# EAGLE design Washer Machine Status Inland ESP32 1206 (EAGLE 9.6.2)
AUTHOR: Eric Snis; REV: 1
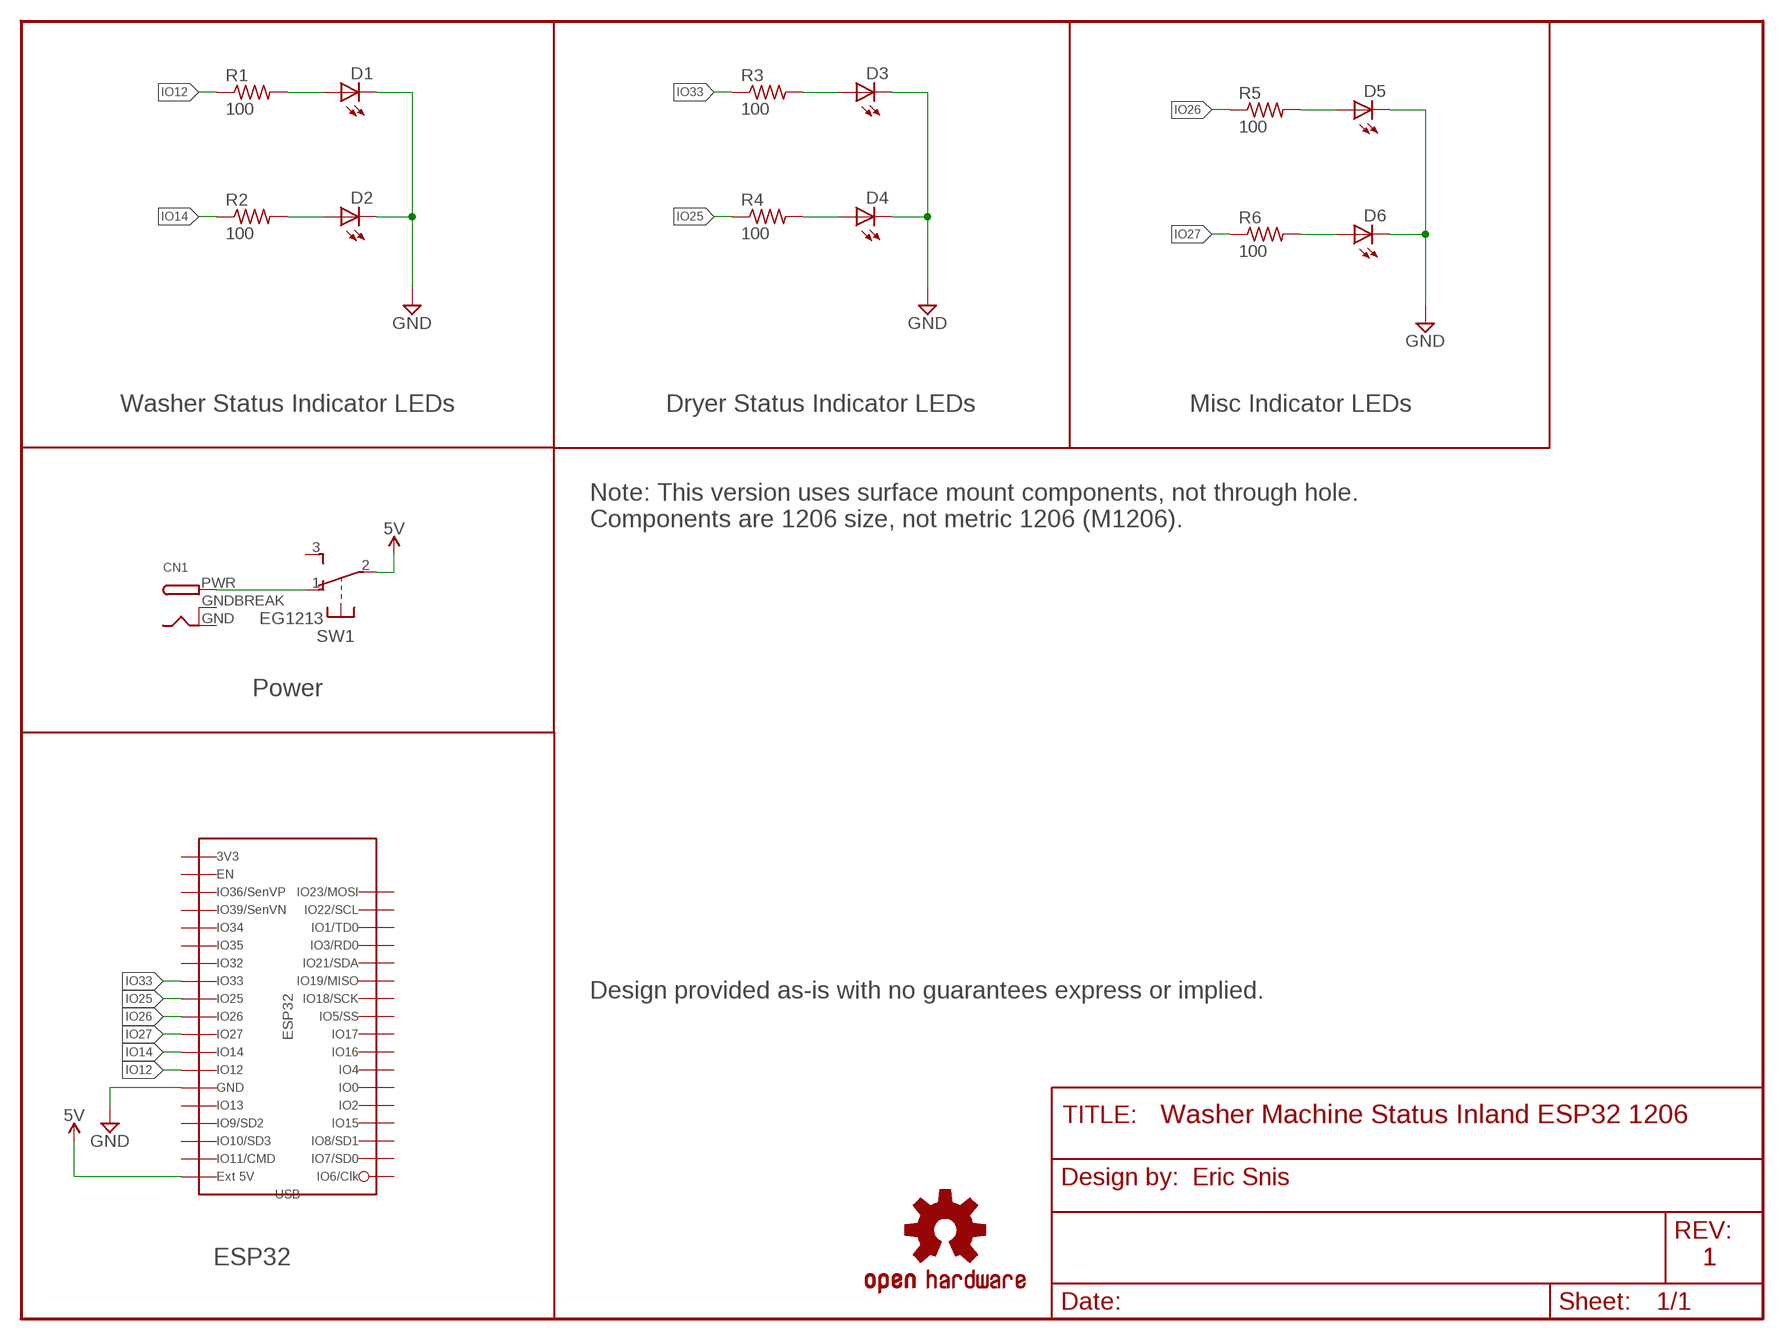
[diagram p0: schematic, sheet 1]

## Parts
CN1  DCBARRELPTH  [DCJACK_2MM_PTH]
D1  Green  LED-CHIPLED_1206_LONG  [CHIPLED_1206_LONG]
D2  Red  LED-CHIPLED_1206_LONG  [CHIPLED_1206_LONG]
D3  Green  LED-CHIPLED_1206_LONG  [CHIPLED_1206_LONG]
D4  Red  LED-CHIPLED_1206_LONG  [CHIPLED_1206_LONG]
D5  Green  LED-CHIPLED_1206_LONG  [CHIPLED_1206_LONG]
D6  Red  LED-CHIPLED_1206_LONG  [CHIPLED_1206_LONG]
LOGO2  OSHW-LOGOMINI  [OSHW-LOGO-MINI]
R1  100  R_USR1206  [R1206]
R2  100  R_USR1206  [R1206]
R3  100  R_USR1206  [R1206]
R4  100  R_USR1206  [R1206]
R5  100  R_USR1206  [R1206]
R6  100  R_USR1206  [R1206]
SW  EG1213  [EG1213]
U$3  ESP32-INLAND  [ESP32_INLAND]

## Nets
5V: SW.2(1:P) U$3.5V(EXT_5V)
GND: D1.C D2.C D3.C D4.C D5.C D6.C U$3.GND1 U$3.GND2(GND1) U$3.GND(GND1)
IO12: R1.1 U$3.IO12
IO14: R2.1 U$3.IO14
IO25: R4.1 U$3.IO25
IO26: R5.1 U$3.IO26
IO27: R6.1 U$3.IO27
IO33: R3.1 U$3.IO33
N$1: CN1.PWR SW.1(1:O)
N$2: D5.A R5.2
N$3: D1.A R1.2
N$4: D2.A R2.2
N$5: D3.A R3.2
N$6: D4.A R4.2
N$7: D6.A R6.2
Unconnected: SW.3(1:S) SW.MT1(MT) SW.MT2(MT) U$3.CLK U$3.CMD(IO11/CMD) U$3.EN U$3.IO0 U$3.IO2 U$3.IO4 U$3.IO5 U$3.IO13 U$3.IO15 U$3.IO16 U$3.IO17 U$3.IO18 U$3.IO19 U$3.IO21(IO21/SDA) U$3.IO22 U$3.IO23(IO23/SCL) U$3.IO32 U$3.IO34 U$3.IO35 U$3.RXD0 U$3.SD0 U$3.SD1 U$3.SD2(IO9/SD2) U$3.SD3(IO10/SD3) U$3.SVN(IO39/SVN) U$3.SVP(IO36/SVP) U$3.TXD0

## Notes on the sheet
- Washer Status Indicator LEDs | Dryer Status Indicator LEDs | Misc Indicator LEDs
- Note: This version uses surface mount components, not through hole.
  Components are 1206 size, not metric 1206 (M1206).
- Power
- Design provided as-is with no guarantees express or implied.
- ESP32

## Power pins joined to a net without a drawn wire
3V3: U$3.3V3
GND: CN1.GND
GNDBREAK: CN1.GNDBREAK

## Library data of the parts
CN1 = connectors:DCBARREL: 2.0mm DC Barrel Jack DCJACK_2MM_PTH - Through Hole Jack (4UConnector: 05537)
D1-D6 = Transistors MOSFETs:LED: LED White LED 0.1" pitch
LOGO2 = SparkFun-Aesthetics:OSHW-LOGO: Open-Source Hardware (OSHW) Logo This logo indicates the piece of hardware it is found on incorporates a OSHW license and/or adheres to the definition of open source hardware found here: http://freedomdefined.org/OSHW
R1-R6 = passives:R_US: Resistor 7mm pin spacing
SW = adafruit:EG1213: E-Switch right-angle slide SPDT Part #EG1213 http://www.ladyada.net/library/eagle
U$3 = connectors:ESP32: ESP-32-Dev ESP32 from Inland/Microcenter

## Board
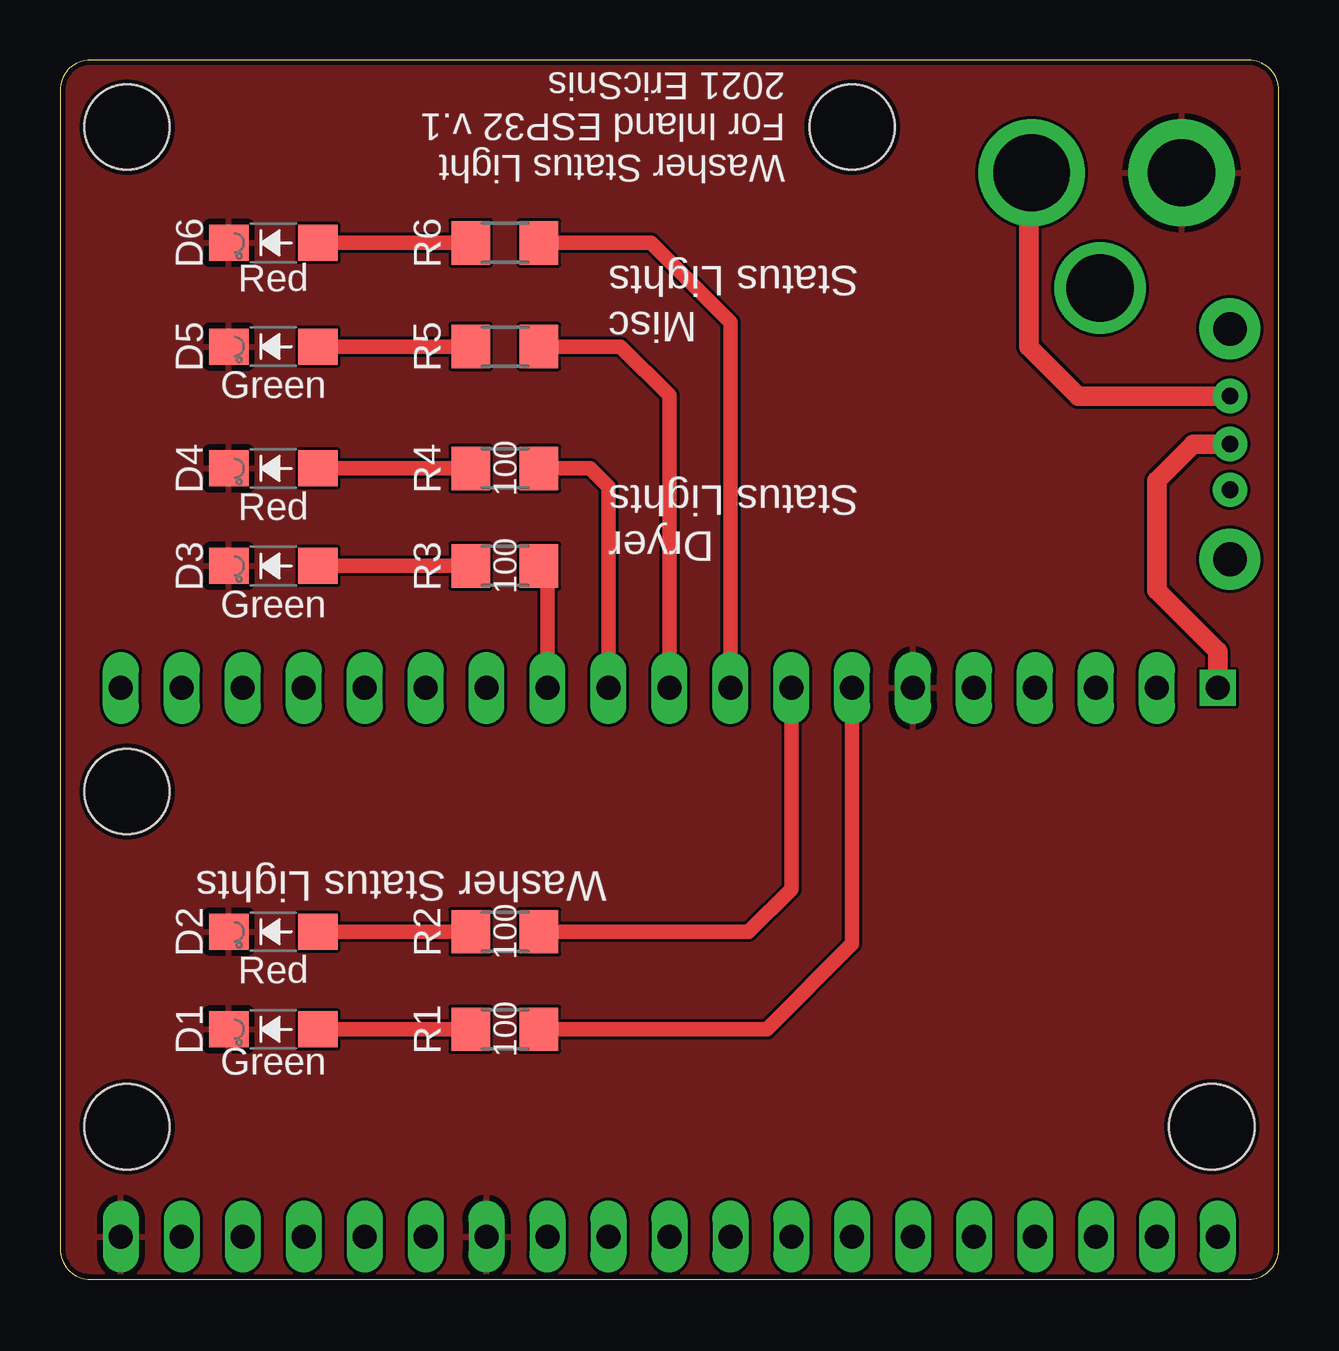
[diagram p1: board, top side]
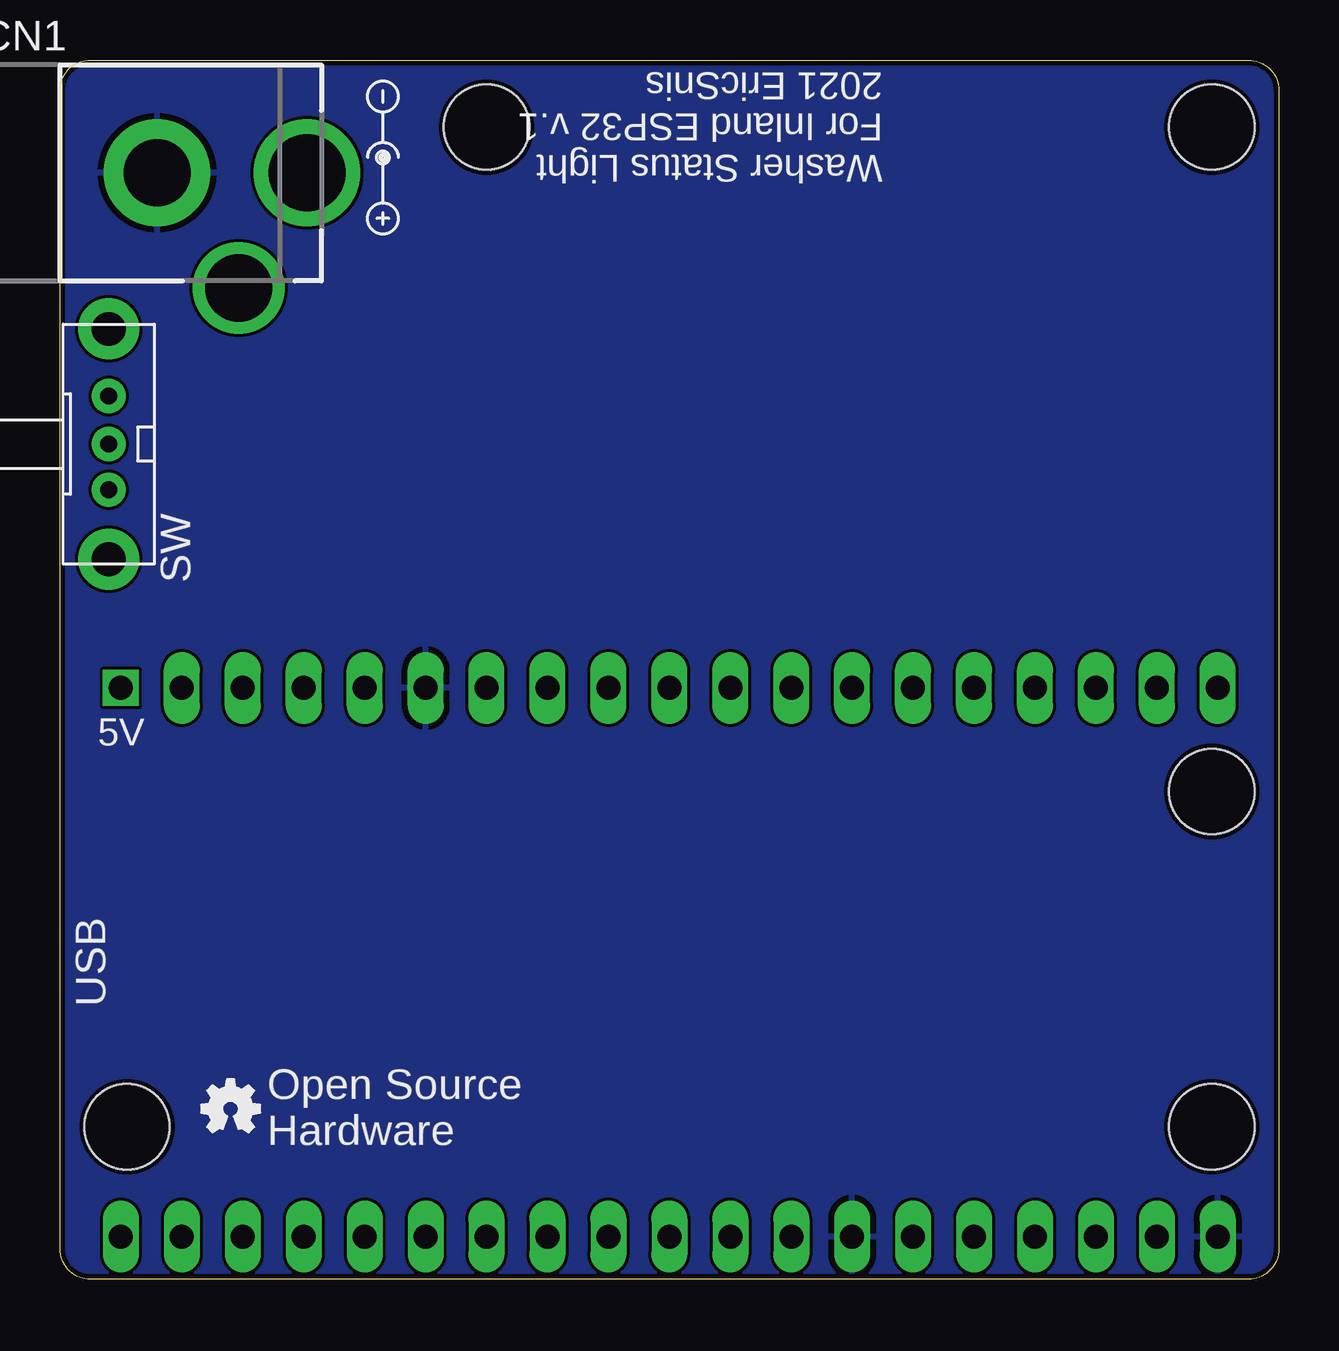
[diagram p2: board, bottom side, seen from below]

Size 50.8 x 50.8 mm. Coordinates in mm from the lower left corner, seen from the top.
Outline: 50.8,1.27 50.8,49.53 arc90 49.53,50.8 1.27,50.8 arc90 0,49.53 0,1.27 arc90 1.27,0 49.53,0 arc90 50.8,1.27
Copper layers (1*16): Top 0.035559375mm / dielectric 1.6mm / Bottom 0.035559375mm
Design rules "Digikey DKRed": minimum track width 5mil, minimum drill 8mil, track to track 5mil, track to pad 5mil, pad to pad 5mil, via to via 5mil, smd to smd 5mil, copper to edge 8mil, drill to drill 6mil, minimum pad ring 5mil, minimum via ring 3mil, stop-mask expansion 2.5mil, vias tented up to drill 0mil, thermal gap 10mil
Holes 3.56 mm at 2.79,6.35 48.01,6.35 2.79,20.32 2.79,48.01 33.02,48.01

### Footprints (pad centres in the part's own frame; a part is rotated, then mirrored left to right if it is on the bottom)
DCJACK_2MM_PTH = drill 2.8 pad 4.445: GND 0,7.35 | drill 2.8: GNDBREAK 4.8,10.75 | drill 3.2 pad 4.445: PWR 0,13.6
CHIPLED_1206_LONG = smd 1.5 x 1.651: A 0,-1.854; C 0,1.854
R1206 = smd 1.6 x 1.803: 1 -1.422,0; 2 1.422,0
EG1213 = drill 0.7 pad 1.422: 1 -2,0; 2 0,0; 3 1.9,0 | drill 1.4 pad 2.54: MT1 -4.8,0; MT2 4.8,0
ESP32_INLAND = drill 1 long: 3V3 11.43,-22.86; CLK -11.43,22.86; CMD 11.43,20.32; EN 11.43,-20.32; GND 11.43,10.16; GND1 -11.43,-22.86; GND2 -11.43,-7.62; IO0 -11.43,10.16; IO2 -11.43,12.7; IO4 -11.43,7.62; IO5 -11.43,0; IO12 11.43,7.62; IO13 11.43,12.7; IO14 11.43,5.08; IO15 -11.43,15.24; IO16 -11.43,5.08; IO17 -11.43,2.54; IO18 -11.43,-2.54; IO19 -11.43,-5.08; IO21 -11.43,-10.16; IO22 -11.43,-17.78; IO23 -11.43,-20.32; IO25 11.43,-2.54; IO26 11.43,0; IO27 11.43,2.54; IO32 11.43,-7.62; IO33 11.43,-5.08; IO34 11.43,-12.7; IO35 11.43,-10.16; RXD0 -11.43,-12.7; SD0 -11.43,20.32; SD1 -11.43,17.78; SD2 11.43,15.24; SD3 11.43,17.78; SVN 11.43,-15.24; SVP 11.43,-17.78; TXD0 -11.43,-15.24 | drill 1 square: 5V 11.43,22.86

### Placement (x,y rotation side)
CN1  54.1,46.1 270 bottom
D1  8.89,10.41 90 top
D2  8.89,14.48 90 top
D3  8.89,29.72 90 top
D4  8.89,33.78 90 top
D5  8.89,38.86 90 top
D6  8.89,43.18 90 top
LOGO2  43.69,7.11 0 bottom
R1  18.54,10.41 180 top
R2  18.54,14.48 180 top
R3  18.54,29.72 180 top
R4  18.54,33.78 180 top
R5  18.54,38.86 180 top
R6  18.54,43.18 180 top
SW  48.77,34.8 270 bottom
U$1  [CENTER-POS-SMALL]  37.34,46.74 90 bottom
U$3  25.4,13.21 90 bottom

### Tracks (layer width: path | path; a pad name or v marks a point on that pad's centre or on a via)
5V
  Top 0.813: U$3.5V 48.26,26.16 45.72,28.7 45.72,33.27 47.24,34.8 SW.2
GND
  pour Top (isolate 0.001): 50.8,1.27 50.8,49.53 arc90 49.53,50.8 1.27,50.8 arc90 0,49.53 0,1.27 arc90 1.27,0 49.53,0 arc90
  pour Bottom (isolate 0.001): 50.8,1.27 50.8,49.53 arc90 49.53,50.8 1.27,50.8 arc90 0,49.53 0,1.27 arc90 1.27,0 49.53,0 arc90
IO12
  Top 0.61: R1.1 29.46,10.41 33.02,13.97 U$3.IO12
IO14
  Top 0.61: U$3.IO14 30.48,16.26 28.7,14.48 R2.1
IO25
  Top 0.61: U$3.IO25 22.86,33.02 22.1,33.78 R4.1
IO26
  Top 0.61: U$3.IO26 25.4,36.83 23.37,38.86 R5.1
IO27
  Top 0.61: U$3.IO27 27.94,39.88 24.64,43.18 R6.1
IO33
  Top 0.61: U$3.IO33 20.32,29.36 R3.1
N$1
  Top 0.813: SW.1 42.45,36.8 40.39,38.86 40.39,45.98 CN1.PWR
N$2
  Top 0.61: R5.2 D5.A
N$3
  Top 0.61: R1.2 D1.A
N$4
  Top 0.61: R2.2 D2.A
N$5
  Top 0.61: R3.2 D3.A
N$6
  Top 0.61: R4.2 D4.A
N$7
  Top 0.61: R6.2 D6.A

### Text on the board
tPlace: Washer Status Light / For Inland ESP32 v.1 / 2021 EricSnis | Misc / Status Lights | Dryer / Status Lights | Washer Status Lights
bPlace: Washer Status Light / For Inland ESP32 v.1 / 2021 EricSnis | 5V | USB | Open Source / Hardware